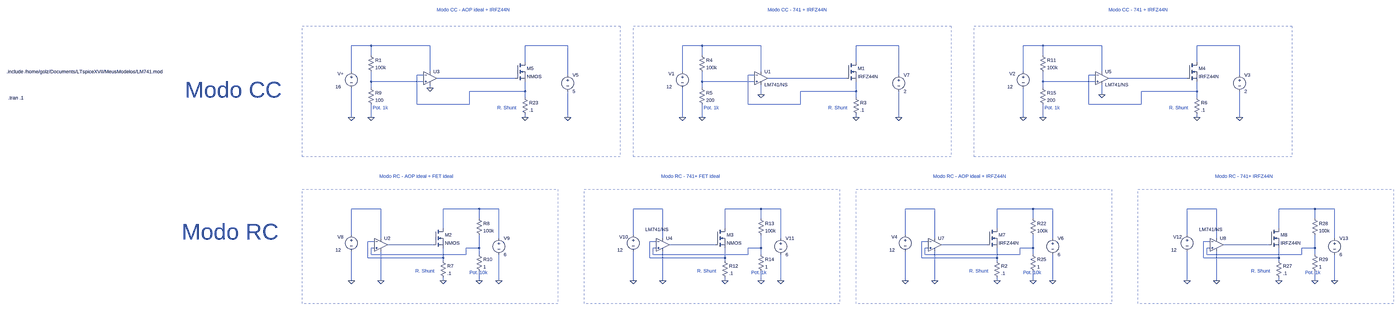
[diagram p0: schematic SimCargaEletronica.asc, whole sheet]
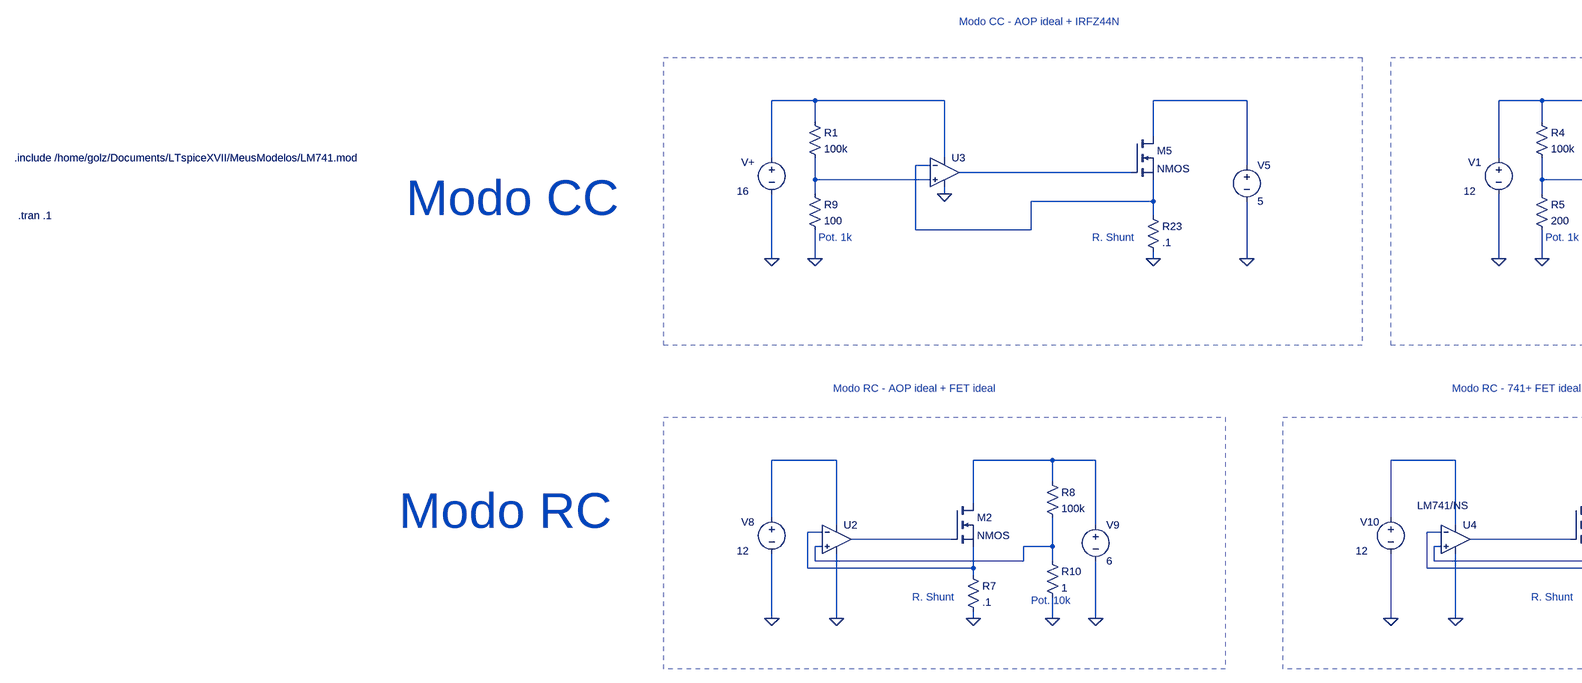
[diagram p1: schematic SimCargaEletronica.asc, part, row 1 of 1, column 1 of 2]
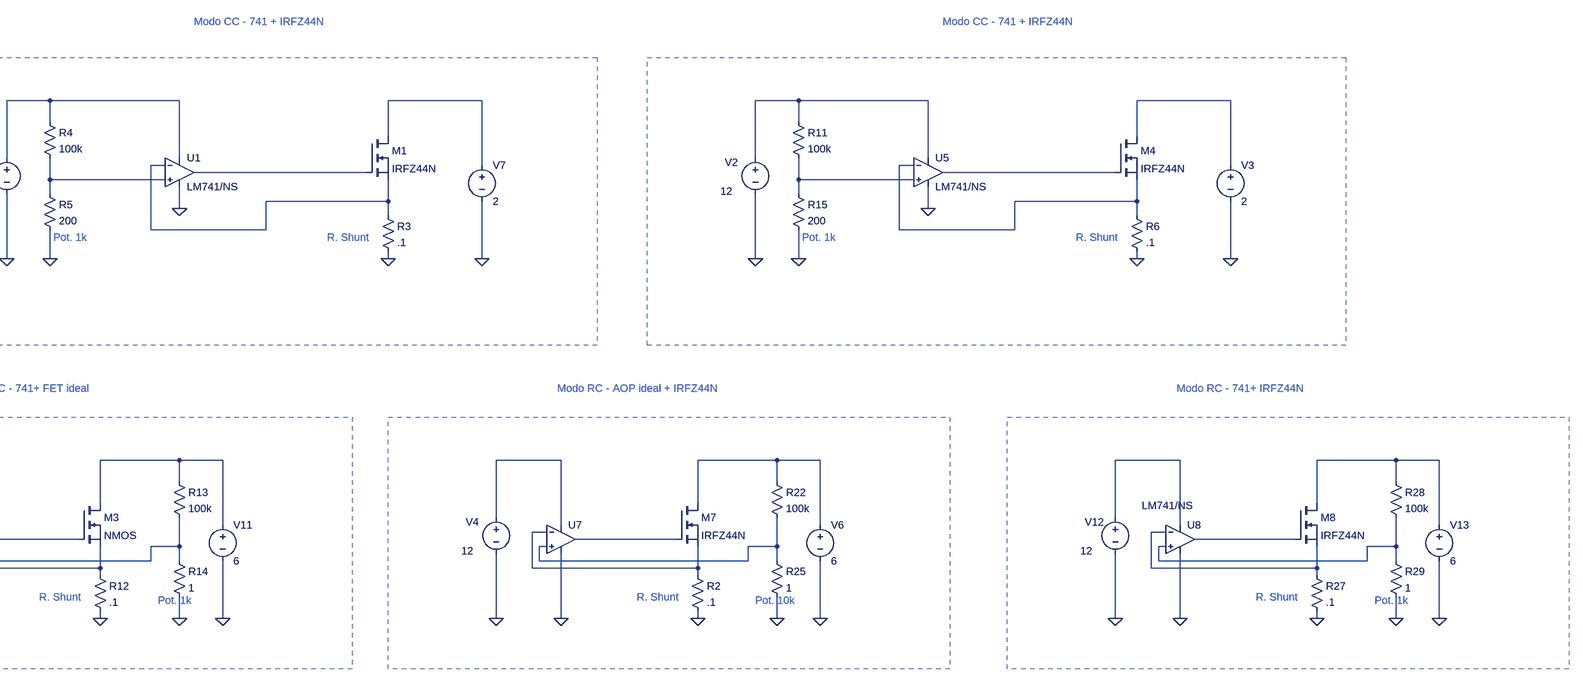
[diagram p2: schematic SimCargaEletronica.asc, part, row 1 of 1, column 2 of 2]
SimCargaEletronica.asc, the LTspice schematic file:
Version 4
SHEET 1 8676 3748
WIRE 704 1728 608 1728
WIRE 992 1728 704 1728
WIRE 1664 1728 1456 1728
WIRE 2320 1728 2224 1728
WIRE 2608 1728 2320 1728
WIRE 3280 1728 3072 1728
WIRE 3984 1728 3888 1728
WIRE 4272 1728 3984 1728
WIRE 4944 1728 4736 1728
WIRE 704 1776 704 1728
WIRE 2320 1776 2320 1728
WIRE 3984 1776 3984 1728
WIRE 1456 1808 1456 1728
WIRE 3072 1808 3072 1728
WIRE 4736 1808 4736 1728
WIRE 608 1856 608 1728
WIRE 992 1856 992 1728
WIRE 2224 1856 2224 1728
WIRE 2608 1856 2608 1728
WIRE 3888 1856 3888 1728
WIRE 4272 1856 4272 1728
WIRE 960 1872 928 1872
WIRE 1664 1872 1664 1728
WIRE 2576 1872 2544 1872
WIRE 3280 1872 3280 1728
WIRE 4240 1872 4208 1872
WIRE 4944 1872 4944 1728
WIRE 1408 1888 1024 1888
WIRE 3024 1888 2640 1888
WIRE 4688 1888 4304 1888
WIRE 704 1904 704 1856
WIRE 960 1904 704 1904
WIRE 2320 1904 2320 1856
WIRE 2576 1904 2320 1904
WIRE 3984 1904 3984 1856
WIRE 4240 1904 3984 1904
WIRE 704 1936 704 1904
WIRE 992 1936 992 1920
WIRE 2320 1936 2320 1904
WIRE 3984 1936 3984 1904
WIRE 1456 1952 1456 1904
WIRE 1456 1952 1184 1952
WIRE 3072 1952 3072 1904
WIRE 3072 1952 2800 1952
WIRE 4736 1952 4736 1904
WIRE 4736 1952 4464 1952
WIRE 2608 1968 2608 1920
WIRE 4272 1968 4272 1920
WIRE 1456 1984 1456 1952
WIRE 3072 1984 3072 1952
WIRE 4736 1984 4736 1952
WIRE 928 2016 928 1872
WIRE 1184 2016 1184 1952
WIRE 1184 2016 928 2016
WIRE 2544 2016 2544 1872
WIRE 2800 2016 2800 1952
WIRE 2800 2016 2544 2016
WIRE 4208 2016 4208 1872
WIRE 4464 2016 4464 1952
WIRE 4464 2016 4208 2016
WIRE 608 2080 608 1936
WIRE 704 2080 704 2016
WIRE 1456 2080 1456 2064
WIRE 1664 2080 1664 1952
WIRE 2224 2080 2224 1936
WIRE 2320 2080 2320 2016
WIRE 3072 2080 3072 2064
WIRE 3280 2080 3280 1952
WIRE 3888 2080 3888 1936
WIRE 3984 2080 3984 2016
WIRE 4736 2080 4736 2064
WIRE 4944 2080 4944 1952
WIRE 752 2528 608 2528
WIRE 1232 2528 1056 2528
WIRE 1328 2528 1232 2528
WIRE 2128 2528 1984 2528
WIRE 2608 2528 2432 2528
WIRE 2704 2528 2608 2528
WIRE 3456 2528 3312 2528
WIRE 3936 2528 3760 2528
WIRE 4032 2528 3936 2528
WIRE 4832 2528 4688 2528
WIRE 5312 2528 5136 2528
WIRE 5408 2528 5312 2528
WIRE 1232 2576 1232 2528
WIRE 2608 2576 2608 2528
WIRE 3936 2576 3936 2528
WIRE 5312 2576 5312 2528
WIRE 1056 2624 1056 2528
WIRE 2432 2624 2432 2528
WIRE 3760 2624 3760 2528
WIRE 5136 2624 5136 2528
WIRE 608 2656 608 2528
WIRE 1984 2656 1984 2528
WIRE 3312 2656 3312 2528
WIRE 4688 2656 4688 2528
WIRE 752 2672 752 2528
WIRE 1328 2672 1328 2528
WIRE 2128 2672 2128 2528
WIRE 2704 2672 2704 2528
WIRE 3456 2672 3456 2528
WIRE 4032 2672 4032 2528
WIRE 4832 2672 4832 2528
WIRE 5408 2672 5408 2528
WIRE 720 2688 688 2688
WIRE 2096 2688 2064 2688
WIRE 3424 2688 3392 2688
WIRE 4800 2688 4768 2688
WIRE 1008 2704 784 2704
WIRE 2384 2704 2160 2704
WIRE 3712 2704 3488 2704
WIRE 5088 2704 4864 2704
WIRE 720 2720 704 2720
WIRE 1232 2720 1232 2656
WIRE 1232 2720 1168 2720
WIRE 2096 2720 2080 2720
WIRE 2608 2720 2608 2656
WIRE 2608 2720 2544 2720
WIRE 3424 2720 3408 2720
WIRE 3936 2720 3936 2656
WIRE 3936 2720 3872 2720
WIRE 4800 2720 4784 2720
WIRE 5312 2720 5312 2656
WIRE 5312 2720 5248 2720
WIRE 704 2752 704 2720
WIRE 1168 2752 1168 2720
WIRE 1168 2752 704 2752
WIRE 1232 2752 1232 2720
WIRE 2080 2752 2080 2720
WIRE 2544 2752 2544 2720
WIRE 2544 2752 2080 2752
WIRE 2608 2752 2608 2720
WIRE 3408 2752 3408 2720
WIRE 3872 2752 3872 2720
WIRE 3872 2752 3408 2752
WIRE 3936 2752 3936 2720
WIRE 4784 2752 4784 2720
WIRE 5248 2752 5248 2720
WIRE 5248 2752 4784 2752
WIRE 5312 2752 5312 2720
WIRE 688 2768 688 2688
WIRE 1056 2768 1056 2720
WIRE 1056 2768 688 2768
WIRE 2064 2768 2064 2688
WIRE 2432 2768 2432 2720
WIRE 2432 2768 2064 2768
WIRE 3392 2768 3392 2688
WIRE 3760 2768 3760 2720
WIRE 3760 2768 3392 2768
WIRE 4768 2768 4768 2688
WIRE 5136 2768 5136 2720
WIRE 5136 2768 4768 2768
WIRE 1056 2784 1056 2768
WIRE 2432 2784 2432 2768
WIRE 3760 2784 3760 2768
WIRE 5136 2784 5136 2768
WIRE 608 2880 608 2736
WIRE 752 2880 752 2736
WIRE 1056 2880 1056 2864
WIRE 1232 2880 1232 2832
WIRE 1328 2880 1328 2752
WIRE 1984 2880 1984 2736
WIRE 2128 2880 2128 2736
WIRE 2432 2880 2432 2864
WIRE 2608 2880 2608 2832
WIRE 2704 2880 2704 2752
WIRE 3312 2880 3312 2736
WIRE 3456 2880 3456 2736
WIRE 3760 2880 3760 2864
WIRE 3936 2880 3936 2832
WIRE 4032 2880 4032 2752
WIRE 4688 2880 4688 2736
WIRE 4832 2880 4832 2736
WIRE 5136 2880 5136 2864
WIRE 5312 2880 5312 2832
WIRE 5408 2880 5408 2752
FLAG 608 2080 0
FLAG 1456 2080 0
FLAG 1664 2080 0
FLAG 704 2080 0
FLAG 2224 2080 0
FLAG 2608 1968 0
FLAG 3072 2080 0
FLAG 3280 2080 0
FLAG 2320 2080 0
FLAG 992 1936 0
FLAG 608 2880 0
FLAG 1056 2880 0
FLAG 1328 2880 0
FLAG 752 2880 0
FLAG 1232 2880 0
FLAG 1984 2880 0
FLAG 2432 2880 0
FLAG 2704 2880 0
FLAG 2128 2880 0
FLAG 2608 2880 0
FLAG 3312 2880 0
FLAG 3760 2880 0
FLAG 4032 2880 0
FLAG 3456 2880 0
FLAG 3936 2880 0
FLAG 4688 2880 0
FLAG 5136 2880 0
FLAG 5408 2880 0
FLAG 4832 2880 0
FLAG 5312 2880 0
FLAG 3888 2080 0
FLAG 4272 1968 0
FLAG 4736 2080 0
FLAG 4944 2080 0
FLAG 3984 2080 0
DATAFLAG 2672 2528 "-I(V9)"
DATAFLAG 1520 1728 "Id(M5)"
SYMBOL voltage 608 1840 R0
WINDOW 123 0 0 Left 0
WINDOW 39 0 0 Left 0
WINDOW 0 -68 26 Left 2
WINDOW 3 -78 90 Left 2
SYMATTR InstName V+
SYMATTR Value 16
SYMBOL res 1440 1968 R0
SYMATTR InstName R23
SYMATTR Value .1
SYMBOL voltage 1664 1856 R0
WINDOW 123 0 0 Left 0
WINDOW 39 0 0 Left 0
SYMATTR InstName V5
SYMATTR Value 5
SYMBOL res 688 1760 R0
SYMATTR InstName R1
SYMATTR Value 100k
SYMBOL res 688 1920 R0
SYMATTR InstName R9
SYMATTR Value 100
SYMBOL OpAmps\\opamp2 2608 1824 R0
SYMATTR InstName U1
SYMATTR Value LM741/NS
SYMBOL voltage 2224 1840 R0
WINDOW 123 0 0 Left 0
WINDOW 39 0 0 Left 0
WINDOW 0 -68 26 Left 2
WINDOW 3 -78 90 Left 2
SYMATTR InstName V1
SYMATTR Value 12
SYMBOL nmos 3024 1808 R0
SYMATTR InstName M1
SYMATTR Value IRFZ44N
SYMBOL res 3056 1968 R0
SYMATTR InstName R3
SYMATTR Value .1
SYMBOL voltage 3280 1856 R0
WINDOW 123 0 0 Left 0
WINDOW 39 0 0 Left 0
SYMATTR InstName V7
SYMATTR Value 2
SYMBOL res 2304 1760 R0
SYMATTR InstName R4
SYMATTR Value 100k
SYMBOL res 2304 1920 R0
SYMATTR InstName R5
SYMATTR Value 200
SYMBOL OpAmps\\UniversalOpamp 992 1888 R0
SYMATTR InstName U3
SYMATTR SpiceModel level1
SYMBOL voltage 608 2640 R0
WINDOW 123 0 0 Left 0
WINDOW 39 0 0 Left 0
WINDOW 0 -68 26 Left 2
WINDOW 3 -78 90 Left 2
SYMATTR InstName V8
SYMATTR Value 12
SYMBOL res 1040 2768 R0
SYMATTR InstName R7
SYMATTR Value .1
SYMBOL voltage 1328 2656 R0
WINDOW 123 0 0 Left 0
WINDOW 39 0 0 Left 0
SYMATTR InstName V9
SYMATTR Value 6
SYMBOL OpAmps\\UniversalOpamp 752 2704 R0
SYMATTR InstName U2
SYMATTR SpiceModel level1
SYMBOL res 1216 2560 R0
SYMATTR InstName R8
SYMATTR Value 100k
SYMBOL res 1216 2736 R0
SYMATTR InstName R10
SYMATTR Value 1
SYMBOL voltage 1984 2640 R0
WINDOW 123 0 0 Left 0
WINDOW 39 0 0 Left 0
WINDOW 0 -68 26 Left 2
WINDOW 3 -78 90 Left 2
SYMATTR InstName V10
SYMATTR Value 12
SYMBOL res 2416 2768 R0
SYMATTR InstName R12
SYMATTR Value .1
SYMBOL voltage 2704 2656 R0
WINDOW 123 0 0 Left 0
WINDOW 39 0 0 Left 0
SYMATTR InstName V11
SYMATTR Value 6
SYMBOL res 2592 2560 R0
SYMATTR InstName R13
SYMATTR Value 100k
SYMBOL res 2592 2736 R0
SYMATTR InstName R14
SYMATTR Value 1
SYMBOL OpAmps\\opamp2 2128 2640 R0
WINDOW 3 -85 -11 Left 2
SYMATTR Value LM741/NS
SYMATTR InstName U4
SYMBOL voltage 3312 2640 R0
WINDOW 123 0 0 Left 0
WINDOW 39 0 0 Left 0
WINDOW 0 -68 26 Left 2
WINDOW 3 -78 90 Left 2
SYMATTR InstName V4
SYMATTR Value 12
SYMBOL res 3744 2768 R0
SYMATTR InstName R2
SYMATTR Value .1
SYMBOL voltage 4032 2656 R0
WINDOW 123 0 0 Left 0
WINDOW 39 0 0 Left 0
SYMATTR InstName V6
SYMATTR Value 6
SYMBOL OpAmps\\UniversalOpamp 3456 2704 R0
SYMATTR InstName U7
SYMATTR SpiceModel level1
SYMBOL nmos 3712 2624 R0
SYMATTR InstName M7
SYMATTR Value IRFZ44N
SYMBOL res 3920 2560 R0
SYMATTR InstName R22
SYMATTR Value 100k
SYMBOL res 3920 2736 R0
SYMATTR InstName R25
SYMATTR Value 1
SYMBOL voltage 4688 2640 R0
WINDOW 123 0 0 Left 0
WINDOW 39 0 0 Left 0
WINDOW 0 -68 26 Left 2
WINDOW 3 -78 90 Left 2
SYMATTR InstName V12
SYMATTR Value 12
SYMBOL res 5120 2768 R0
SYMATTR InstName R27
SYMATTR Value .1
SYMBOL voltage 5408 2656 R0
WINDOW 123 0 0 Left 0
WINDOW 39 0 0 Left 0
SYMATTR InstName V13
SYMATTR Value 6
SYMBOL nmos 5088 2624 R0
SYMATTR InstName M8
SYMATTR Value IRFZ44N
SYMBOL res 5296 2560 R0
SYMATTR InstName R28
SYMATTR Value 100k
SYMBOL res 5296 2736 R0
SYMATTR InstName R29
SYMATTR Value 1
SYMBOL OpAmps\\opamp2 4832 2640 R0
WINDOW 3 -85 -11 Left 2
SYMATTR Value LM741/NS
SYMATTR InstName U8
SYMBOL nmos 2384 2624 R0
SYMATTR InstName M3
SYMBOL nmos 1008 2624 R0
SYMATTR InstName M2
SYMBOL OpAmps\\opamp2 4272 1824 R0
SYMATTR InstName U5
SYMATTR Value LM741/NS
SYMBOL voltage 3888 1840 R0
WINDOW 123 0 0 Left 0
WINDOW 39 0 0 Left 0
WINDOW 0 -68 26 Left 2
WINDOW 3 -78 90 Left 2
SYMATTR InstName V2
SYMATTR Value 12
SYMBOL nmos 4688 1808 R0
SYMATTR InstName M4
SYMATTR Value IRFZ44N
SYMBOL res 4720 1968 R0
SYMATTR InstName R6
SYMATTR Value .1
SYMBOL voltage 4944 1856 R0
WINDOW 123 0 0 Left 0
WINDOW 39 0 0 Left 0
SYMATTR InstName V3
SYMATTR Value 2
SYMBOL res 3968 1760 R0
SYMATTR InstName R11
SYMATTR Value 100k
SYMBOL res 3968 1920 R0
SYMATTR InstName R15
SYMATTR Value 200
SYMBOL nmos 1408 1808 R0
SYMATTR InstName M5
TEXT -1496 1984 Left 2 !.tran .1
TEXT 712 2032 Left 2 ;Pot. 1k
TEXT 1320 2032 Left 2 ;R. Shunt
TEXT 1024 1552 Left 2 ;Modo CC - AOP ideal + IRFZ44N
TEXT -1504 1856 Left 2 !.include /home/golz/Documents/LTspiceXVII/MeusModelos/LM741.mod
TEXT 2328 2032 Left 2 ;Pot. 1k
TEXT 2936 2032 Left 2 ;R. Shunt
TEXT 2640 1552 Left 2 ;Modo CC - 741 + IRFZ44N
TEXT -248 1944 Left 7 ;Modo CC
TEXT -264 2640 Left 7 ;Modo RC
TEXT 920 2832 Left 2 ;R. Shunt
TEXT 744 2368 Left 2 ;Modo RC - AOP ideal + FET ideal
TEXT 1184 2840 Left 2 ;Pot. 10k
TEXT 2296 2832 Left 2 ;R. Shunt
TEXT 2120 2368 Left 2 ;Modo RC - 741+ FET ideal
TEXT 2560 2840 Left 2 ;Pot. 1k
TEXT 3624 2832 Left 2 ;R. Shunt
TEXT 3448 2368 Left 2 ;Modo RC - AOP ideal + IRFZ44N
TEXT 3888 2840 Left 2 ;Pot. 10k
TEXT 5000 2832 Left 2 ;R. Shunt
TEXT 4824 2368 Left 2 ;Modo RC - 741+ IRFZ44N
TEXT 5264 2840 Left 2 ;Pot. 1k
TEXT 3992 2032 Left 2 ;Pot. 1k
TEXT 4600 2032 Left 2 ;R. Shunt
TEXT 4304 1552 Left 2 ;Modo CC - 741 + IRFZ44N
RECTANGLE Normal 1920 2272 368 1632 2
RECTANGLE Normal 3536 2272 1984 1632 2
RECTANGLE Normal 1616 2992 368 2432 2
RECTANGLE Normal 2992 2992 1744 2432 2
RECTANGLE Normal 4320 2992 3072 2432 2
RECTANGLE Normal 5696 2992 4448 2432 2
RECTANGLE Normal 5200 2272 3648 1632 2

The netlist it stands for:
* SimCargaEletronica.asc
V+ N001 0 16
R23 N007 0 .1
V5 N002 0 5
R1 N001 N013 100k
R9 N013 0 100
XU1 N014 N008 N003 0 N011 LM741/NS  ; pins In+ In- V+ V- OUT
V1 N003 0 12
M1 N004 N011 N008 N008 IRFZ44N
R3 N008 0 .1
V7 N004 0 2
R4 N003 N014 100k
R5 N014 0 200
XU3 N013 N007 N001 0 N010 level1 Avol=1Meg GBW=10Meg Vos=0 En=0 Enk=0 In=0 Ink=0 Rin=500Meg  ; pins In+ In- V+ V- OUT
V8 N016 0 12
R7 N024 0 .1
V9 N017 0 6
XU2 N032 N024 N016 0 N028 level1 Avol=1Meg GBW=10Meg Vos=0 En=0 Enk=0 In=0 Ink=0 Rin=500Meg  ; pins In+ In- V+ V- OUT
R8 N017 N032 100k
R10 N032 0 1
V10 N018 0 12
R12 N025 0 .1
V11 N019 0 6
R13 N019 N033 100k
R14 N033 0 1
XU4 N033 N025 N018 0 N029 LM741/NS  ; pins In+ In- V+ V- OUT
V4 N020 0 12
R2 N026 0 .1
V6 N021 0 6
XU7 N034 N026 N020 0 N030 level1 Avol=1Meg GBW=10Meg Vos=0 En=0 Enk=0 In=0 Ink=0 Rin=500Meg  ; pins In+ In- V+ V- OUT
M7 N021 N030 N026 N026 IRFZ44N
R22 N021 N034 100k
R25 N034 0 1
V12 N022 0 12
R27 N027 0 .1
V13 N023 0 6
M8 N023 N031 N027 N027 IRFZ44N
R28 N023 N035 100k
R29 N035 0 1
XU8 N035 N027 N022 0 N031 LM741/NS  ; pins In+ In- V+ V- OUT
M3 N019 N029 N025 N025 NMOS
M2 N017 N028 N024 N024 NMOS
XU5 N015 N009 N005 0 N012 LM741/NS  ; pins In+ In- V+ V- OUT
V2 N005 0 12
M4 N006 N012 N009 N009 IRFZ44N
R6 N009 0 .1
V3 N006 0 2
R11 N005 N015 100k
R15 N015 0 200
M5 N002 N010 N007 N007 NMOS
.model NMOS NMOS
.model PMOS PMOS
.lib standard.mos
.tran .1
* Pot. 1k
* R. Shunt
* Modo CC - AOP ideal + IRFZ44N
.include /home/golz/Documents/LTspiceXVII/MeusModelos/LM741.mod
* Pot. 1k
* R. Shunt
* Modo CC - 741 + IRFZ44N
* Modo CC
* Modo RC
* R. Shunt
* Modo RC - AOP ideal + FET ideal
* Pot. 10k
* R. Shunt
* Modo RC - 741+ FET ideal
* Pot. 1k
* R. Shunt
* Modo RC - AOP ideal + IRFZ44N
* Pot. 10k
* R. Shunt
* Modo RC - 741+ IRFZ44N
* Pot. 1k
* Pot. 1k
* R. Shunt
* Modo CC - 741 + IRFZ44N
.lib UniversalOpAmp1.lib
.backanno
.end